# Altium schematic sheet BUFFER_BTOA.SchDoc
size A4; SheetNumber: 9; SheetTotal: 9
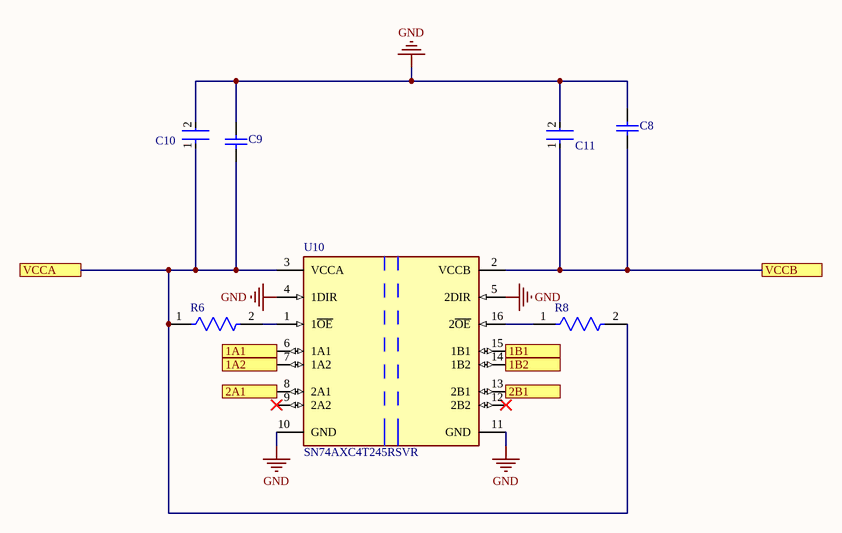
[diagram p0: BUFFER_BTOA.SchDoc]

## Parts
C8  CAP 1uF 16V 0805(2012)  [CAPC0805(2012)100_N]  (value not drawn)
C9  CAP 1uF 16V 0805(2012)  [CAPC0805(2012)100_N]  (value not drawn)
C10  C0805C104K4RAC  [FP-C0805C-DN-MFG]  (value not drawn)
C11  C0805C104K4RAC  [FP-C0805C-DN-MFG]  (value not drawn)
R6  RC0603FR-0710KL  [FP-RC0603-0_55-IPC_C]  (value not drawn)
R8  RC0603FR-0710KL  [FP-RC0603-0_55-IPC_C]  (value not drawn)
U10  SN74AXC4T245RSVR  [FP-RSV0016A-MFG]

## Ports
1A1 (see THE_FIRST[3D]), 1A2 (see THE_FIRST[3D]), 1B1 (see THE_FIRST[4D]), 1B2 (see THE_FIRST[4D]), 2A1 (see THE_FIRST[3D]), 2B1 (see THE_FIRST[4D]), VCCA (see THE_FIRST[3C], BUFFER_ATOB[2B]), VCCB (see THE_FIRST[4C], BUFFER_ATOB[3B])

## Nets
GND: C8.2 C9.2 C10.2 C11.2 U10.4(1DIR) U10.5(2DIR) U10.10(GND) U10.11(GND)
1A1: U10.6(1A1) ; port 1A1
1A2: U10.7(1A2) ; port 1A2
1B1: U10.15(1B1) ; port 1B1
1B2: U10.14(1B2) ; port 1B2
2A1: U10.8(2A1) ; port 2A1
2B1: U10.13(2B1) ; port 2B1
VCCA: C9.1 C10.1 R6.1 R8.2 U10.3(VCCA) ; port VCCA
VCCB: C8.1 C11.1 U10.2(VCCB) ; port VCCB
NetR6_2: R6.2 U10.1(1~{OE})
NetR8_1: R8.1 U10.16(2~{OE})

Not connected (* = marked no-connect by the designer): U10 9(2A2)* 12(2B2)*

## Library data of the parts
C8 C9 = CMP-1036-04747-1: CAP 1uF 16V ±10% 0805 (2012 Metric) Thickness 1mm SMD; Manufacturer: KEMET; Manufacturer Part Number: C0805C105K4RACTU; Tolerance: Â±10%; Case-Metric: 2012; Case-EIA: 0805; Dielectric Material: Ceramic; Multilayer: Yes; Temperature Characteristics Code: X7R; Technology: SMT; Value: 1uF; Rated Voltage: 16 V; Max Thickness: 1 mm; Supplier: Digikey; Supplier Part Number: 399-C0805C105K4RACTUCT-ND; RoHS: Yes; Category: Ceramic Capacitors; Stock: 418697; Pricing: 1=0.12, 10=0.068, 100=0.041, 1000=0.03184 (USD); Mounting Technology: Surface Mount; Pins: 2; Package Shape: Rectangular; Case/Package: 0805; Terminal Finish: Nickel; Min Operating Temperature: -55°C; Max Operating Temperature: 125°C; Capacitor Type: Ceramic; Tolerance  (fill in as +-): 10%; Package Style: SMTMeter; Packaging: Tape and Reel; Tolerance (fill in as +-): 10%; Rated DC Voltage (URdc): 16V; Termination: Wraparound; JESD-609 Code: e3; Length: 2mm; Width: 1.25mm; Height: 0.9mm; Reach SVHC Compliant: Yes; RoHS Compliant: Yes; ComponentLink1URL: https://datasheet.ciiva.com:443/pdfs/VipMasterIC/IC/KEME/KEME-S-A0008991654/KEME-S-A0008991654-1.pdf?src-supplier=IHS+Markit; ComponentLink1Description: https://datasheet.ciiva.com:443/pdfs/VipMasterIC/IC/KEME/KEME-S-A0008991654/KEME-S-A0008991654-1.pdf?src-supplier=IHS+Markit
C10 C11 = CMP-03020-009592-2: C0805 0.10 μF X7R 30ppm/°C 10.00% 16 V; Manufacturer: KEMET; Material: Ceramic; Capacitance: 0.10 μF; Tolerance: 0.1; Value: 0.10 μF; Voltage Rating: 16 V; ComponentLink2Description: Datasheet; Category: Cap; Package: C0805C-DN; Device Class L1: Passive Components; Device Class L3: Ceramic Capacitors; RoHS: TRUE; Height: 0.88mm; Automotive: No; Temperature Range High: +125°C; Octopart: https://octopart.com/c0805c104k4rac-kemet-1343167; Mouser Description: Cap Ceramic 0.1uF 16V X7R 10% Pad SMD 0805 125C Bulk; Lead Free: Yes; Temperature Coefficient: 30ppm/°C; Ipc Land Pattern Name: CAPC200125X78; Manufacturer Part Number: C0805C104K4RAC; Temperature Characteristic: X7R; Device Class L2: Capacitors; Temperature Range Low: -55°C; Temperature: -55°C to +125°C; ComponentLink2URL: https://content.kemet.com/datasheets/KEM_C1003_C0G_SMD.pdf
R6 R8 = CMP-2100-03664-2: RES 10K OHM 1% 1/10W 0603; Manufacturer: Yageo; Voltage Rating: 75V; Voltage Rating (DC): 50V; Resistance: 10kR; Power Rating: 100mW; Temperature Coefficient: 100ppm/°C; Value: 10kR; Rated Temperature: 70°C; Temperature Coefficient (ppm/Cel): 100; Additional Feature: LASER TRIMMABLE; Package Height: 0.45mm; Package Length: 1.6mm; Package Width: 0.8mm; Depth: 0.8mm; Termination: SMD/SMT; Resistor Type: Thick Film; Series: RC; Construction: Rectangular; Features: Moisture Resistant; Packaging: Tape and Reel; Min Operating Temperature: -55°C; Number of Terminations: 2; Lead Pitch: 0.3mm; RoHS Compliant: Yes; Case/Package: 0603; Resistance Tolerance: 1%; Military Standard: Not; Weight: 7.1E-05oz; Number of Pins: 2; Tolerance: 1%; Length: 1.6mm; Case Code (Imperial): 0603; Lead Free: Lead Free; Width: 0.8mm; Max Power Dissipation: 100mW; Height: 0.45mm; Max Operating Temperature: 155°C; Case Code (Metric): 1608; Size Code: 0603; Supplier: Digikey; Supplier Part Number: 311-10.0KHRDKR-ND; Manufacturer Part Number: RC0603FR-0710KL; RoHS: Yes; Category: Chip SMD Resistors; Stock: 3719141; Pricing: 1=0.1, 10=0.009, 100=0.0071, 1000=0.0051 (USD); Mounting Technology: Surface Mount; Pins: 2; Terminal Finish: Nickel; Package Shape: Rectangular; JESD-609 Code: e3; Technology: METAL GLAZE/THICK FILM; Power: 100mW; Working Voltage: 75V; Reach SVHC Compliant: Yes; ComponentLink1URL: https://datasheet.ciiva.com:443/pdfs/VipMasterIC/IC/YAGO/YAGO-S-A0008145938/YAGO-S-A0008145938-1.pdf?src-supplier=IHS+Markit; ComponentLink1Description: https://datasheet.ciiva.com:443/pdfs/VipMasterIC/IC/YAGO/YAGO-S-A0008145938/YAGO-S-A0008145938-1.pdf?src-supplier=IHS+Markit
U10 = CMP-04899-000112-1: IC TRANSLATION TXRX 3.6V 16UQFN; Manufacturer: Texas Instruments; Supplier: Arrow Electronics; Supplier Part Number: SN74AXC4T245RSVR; Manufacturer Part Number: SN74AXC4T245RSVR; RoHS: Yes; Category: Buffers, Drivers and Transceivers; Stock: 1553; Pricing: 1=0.545, 10=0.4644, 25=0.4374, 100=0.405, 250=0.3871, 500=0.3731, 1000=0.3485 (USD); ComponentLink1URL: https://www.ti.com:443/lit/ds/symlink/sn74axc4t245.pdf?src-supplier=IHS+Markit; ComponentLink1Description: https://www.ti.com:443/lit/ds/symlink/sn74axc4t245.pdf?src-supplier=IHS+Markit; ComponentLink2URL: http://www.ti.com/general/docs/suppproductinfo.tsp?distId=10&amp;gotoUrl=http%3A%2F%2Fwww.ti.com%2Flit%2Fgpn%2Fsn74axc4t245&src-supplier=Digikey; ComponentLink2Description: http://www.ti.com/general/docs/suppproductinfo.tsp?distId=10&amp;gotoUrl=http%3A%2F%2Fwww.ti.com%2Flit%2Fgpn%2Fsn74axc4t245&src-supplier=Digikey